# EAGLE design kombi_4x16Arelais01 (EAGLE 4.16)
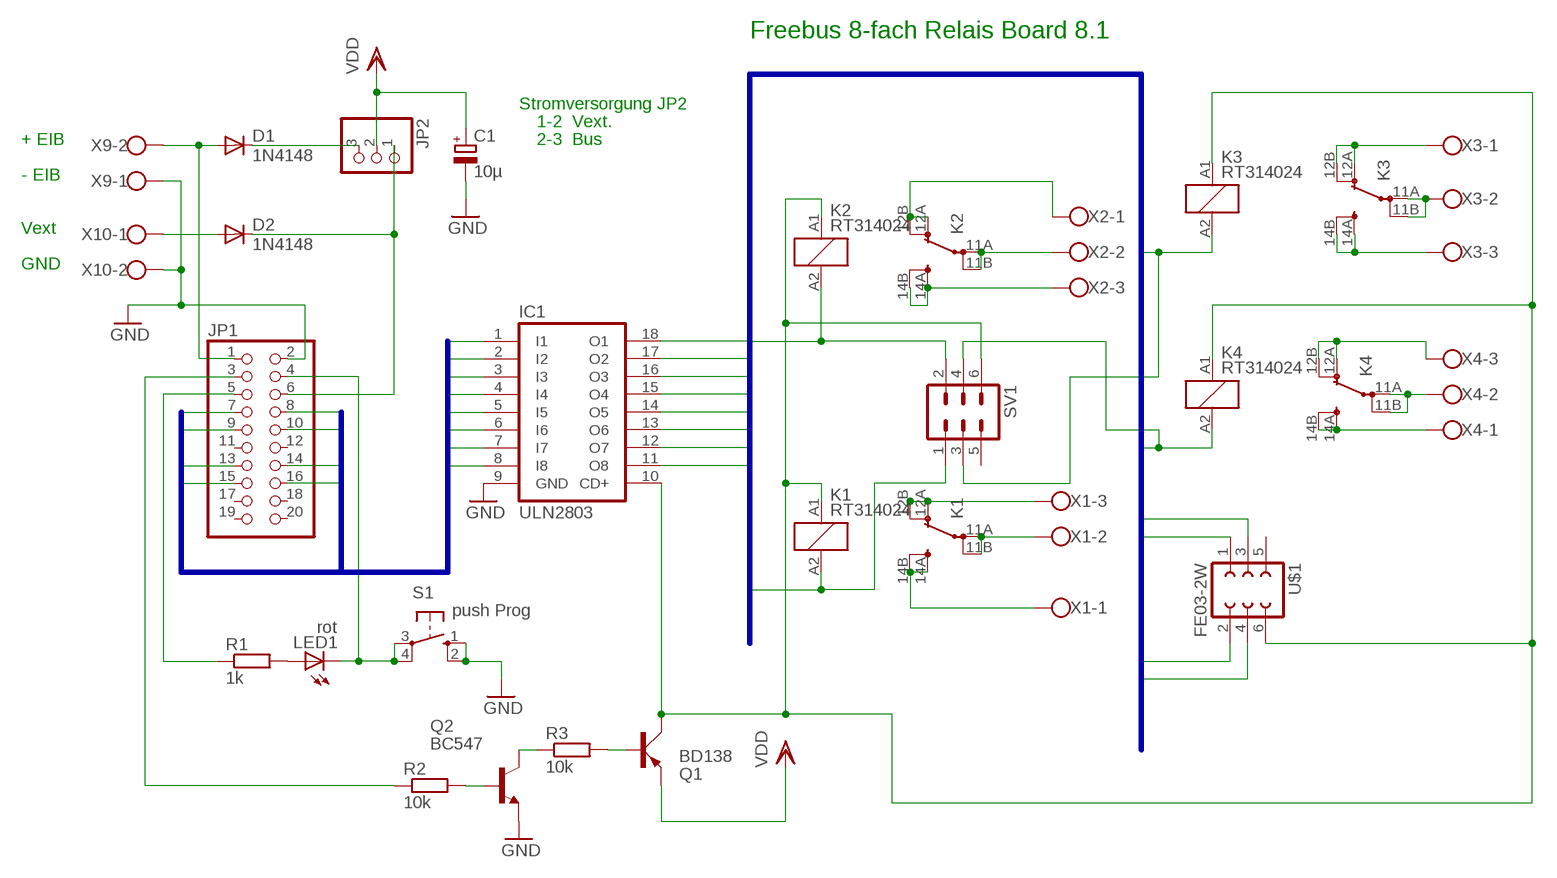
[diagram p0: schematic, sheet 1]

## Parts
C1  10µ  CPOL-EUE3.5-8  [E3,5-8]
D1  1N4148  [DO35-10]
D2  1N4148  [DO35-10]
IC1  ULN2803  ULN2803A  [DIL18]
JP1  PINHD-2X10  [2X10]
JP2  PINHD-1X3  [1X03]
K1  RT314024  [RT-C/O16A5]
K2  RT314024  [RT-C/O16A5]
K3  RT314024  [RT-C/O16A5]
K4  RT314024  [RT-C/O16A5]
LED1  rot  LED3MM  [LED3MM]
Q1  BD138  BD140  [TO126AV]
Q2  BC547  [TO92]
R1  1k  R-EU_0207/10  [0207/10]
R2  10k  R-EU_0207/10  [0207/10]
R3  10k  R-EU_0207/10  [0207/10]
S1  push Prog  10-XX  [B3F-10XX]
SV1  MA03-2LIEGEND  [MA03-2W]
U$1  FE03-2W  [FE03-2W]
X1  W237-03P  [W237-133]
X2  W237-03P  [W237-133]
X3  W237-03P  [W237-133]
X4  W237-03P  [W237-133]
X9  W237-102  [W237-102]
X10  W237-102  [W237-102]

## Nets
GND: C1.- IC1.9(GND) JP1.2 Q2.1(E) S1.1(S) S1.2(S1) X9.1 X10.2
IO1: IC1.1(I1) JP1.16
IO2: IC1.2(I2) JP1.15
IO3: IC1.3(I3) JP1.14
IO4: IC1.4(I4) JP1.13
IO5: IC1.5(I5) JP1.10
IO6: IC1.6(I6) JP1.9
IO7: IC1.7(I7) JP1.8
IO8: IC1.8(I8) JP1.7
N$7: K3.12A(2:OA) K3.12B(2:OB) X3.1
N$8: K4.14A(2:SA) K4.14B(2:SB) X4.1
N$9: K4.11A(2:PA) K4.11B(2:PB) X4.2
N$10: K4.12A(2:OA) K4.12B(2:OB) X4.3
N$11: K3.11A(2:PA) K3.11B(2:PB) X3.2
N$12: K3.14A(2:SA) K3.14B(2:SB) X3.3
N$13: K1.12A(2:OA) K1.12B(2:OB) X1.3
N$14: K1.11A(2:PA) K1.11B(2:PB) X1.2
N$15: K1.14A(2:SA) K1.14B(2:SB) X1.1
N$16: K2.14A(2:SA) K2.14B(2:SB) X2.3
N$17: D2.A X10.1
N$18: K2.11A(2:PA) K2.11B(2:PB) X2.2
N$19: K2.12A(2:OA) K2.12B(2:OB) X2.1
N$20: D1.A JP1.1 X9.2
N$24: JP1.5 R1.1
N$27: JP1.4 LED1.K(C) S1.3(P) S1.4(P1)
N$28: LED1.A R1.2
N$31: D2.C JP1.6 JP2.1
N$32: D1.C JP2.3
N$33: JP1.3 R2.1
N$37: Q1.B R3.2
N$38: Q2.3(C) R3.1
N$39: Q2.2(B) R2.2
PWM_RELAISE: IC1.10(CD+) K1.A1 K2.A1 K3.A1 K4.A1 Q1.C SV1.6 U$1.6
R1: IC1.14(O5) U$1.4
R2: IC1.13(O6) U$1.3
R3: IC1.12(O7) U$1.2
R4: IC1.11(O8) U$1.1
R5: IC1.15(O4) K4.A2 SV1.4
R6: IC1.16(O3) K3.A2 SV1.3
R7: IC1.17(O2) K2.A2 SV1.2
R8: IC1.18(O1) K1.A2 SV1.1
VDD: C1.+ JP2.2 Q1.E
Unconnected: JP1.11 JP1.12 JP1.17 JP1.18 JP1.19 JP1.20 SV1.5 U$1.5

## Buses
R[1..8]
IO[1..8]

## Notes on the sheet
- Freebus 8-fach Relais Board 8.1
- Stromversorgung JP2
- 1-2  Vext.
- + EIB | 2-3  Bus
- - EIB
- Vext
- GND

## Library data of the parts
C1 = rcl:CPOL-EU: POLARIZED CAPACITOR, European symbol
D1 D2 = diode:1N4148: DIODE high speed (Philips)
IC1 = uln-udn:ULN2803A: DRIVER ARRAY
JP1 = pinhead:PINHD-2X10: PIN HEADER
JP2 = pinhead:PINHD-1X3: PIN HEADER
K1-K4 = freebus_relay:RT31*: Power PCB Relayl SCHRACK 1 pole 12 / 16 A, DC- or AC-coi Source: http://www.schrack.com/.. 5819.pdf
LED1 = led:LED: LED OSRAM: - CHIPLED LG R971, LG N971, LY N971, LG Q971, LY Q971, LO R971, LY R971 LH N974, LH R974 LS Q976, LO Q976, LY Q976 LO Q996 - Hyper CHIPLED LW Q18S LB Q993, LB Q99A, LB R99A - SideLED LS A670, LO A670, LY A670, LG A670, LP A670 LB A673, LV A673, LT A673, LW A673 LH A674 LY A675 LS A676, LA A676, LO A676, LY A676, LW A676 LS A679, LY A679, LG A679 - Hyper Micro SIDELED® LS Y876, LA Y876, LO Y876, LY Y876 LT Y87S - SmartLED LW L88C, LW L88S LB L89C, LB L89S, LG L890 LS L89K, LO L89K, LY L89K LS L896, LA L896, LO L896, LY L896 - TOPLED LS T670, LO T670, LY T670, LG T670, LP T670 LSG T670, LSP T670, LSY T670, LOP T670, LYG T670 LG T671, LOG T671, LSG T671 LB T673, LV T673, LT T673, LW T673 LH T674 LS T676, LA T676, LO T676, LY T676, LB T676, LH T676, LSB T676, LW T676 LB T67C, LV T67C, LT T67C, LS T67K, LO T67K, LY T67K, LW E67C LS E67B, LA E67B, LO E67B, LY E67B, LB E67C, LV E67C, LT E67C LW T67C LS T679, LY T679, LG T679 LS T770, LO T770, LY T770, LG T770, LP T770 LB T773, LV T773, LT T773, LW T773 LH T774 LS E675, LA E675, LY E675, LS T675 LS T776, LA T776, LO T776, LY T776, LB T776 LHGB T686 LT T68C, LB T68C - Hyper Mini TOPLED® LB M676 - Mini TOPLED Santana® LG M470 LS M47K, LO M47K, LY M47K Source: http://www.osram.convergy.de - LUMILED® LXK2-PW12-R00, LXK2-PW12-S00, LXK2-PW14-U00, LXK2-PW14-V00 LXK2-PM12-R00, LXK2-PM12-S00, LXK2-PM14-U00 LXK2-PE12-Q00, LXK2-PE12-R00, LXK2-PE12-S00, LXK2-PE14-T00, LXK2-PE14-U00 LXK2-PB12-K00, LXK2-PB12-L00, LXK2-PB12-M00, LXK2-PB14-N00, LXK2-PB14-P00, LXK2-PB14-Q00 LXK2-PR12-L00, LXK2-PR12-M00, LXK2-PR14-Q00, LXK2-PR14-R00 LXK2-PD12-Q00, LXK2-PD12-R00, LXK2-PD12-S00 LXK2-PH12-R00, LXK2-PH12-S00 LXK2-PL12-P00, LXK2-PL12-Q00, LXK2-PL12-R00 Source: www.luxeon.com
Q1 = transistor-power:BD140: PNP TRANSISTOR
Q2 = transistor-npn:BC547*: NPN Transistor
R1-R3 = rcl:R-EU_: RESISTOR, European symbol
S1 = switch-omron:10-XX: OMRON SWITCH
SV1 = con-lstb:MA03-2: PIN HEADER
U$1 = con-lsta:FE03-2W
X1-X4 = con-wago-508:W237-03P: WAGO SREW CLAMP
X9 X10 = con-wago-500:W237-102: WAGO SCREW CLAMP

## Board
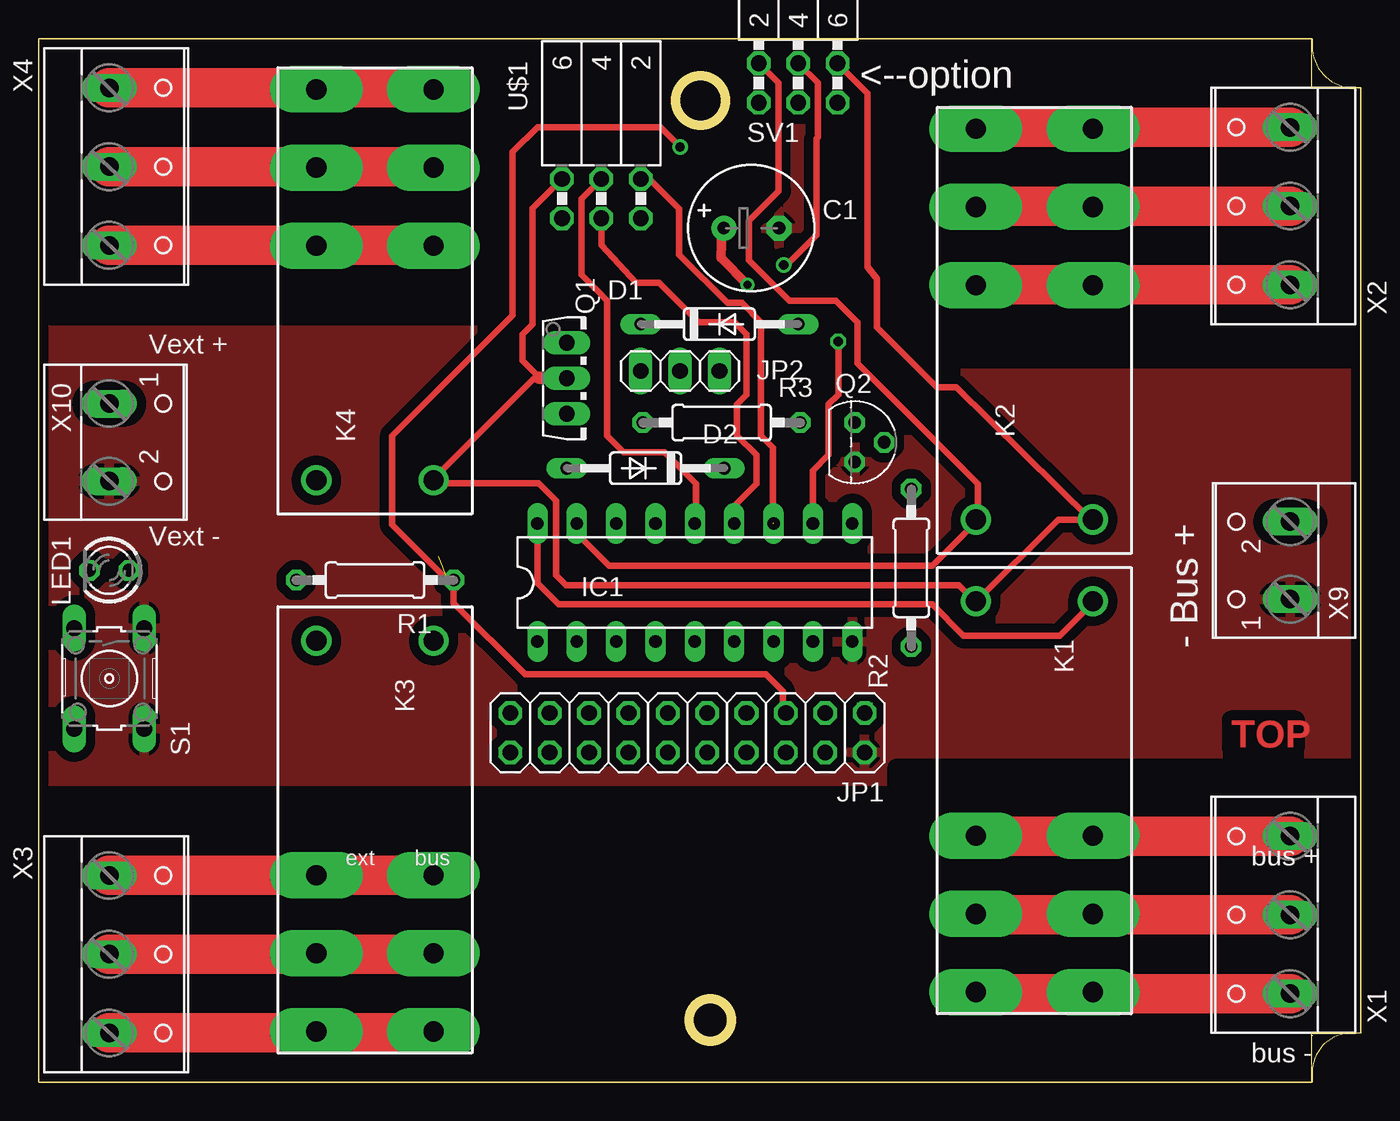
[diagram p1: board, top side]
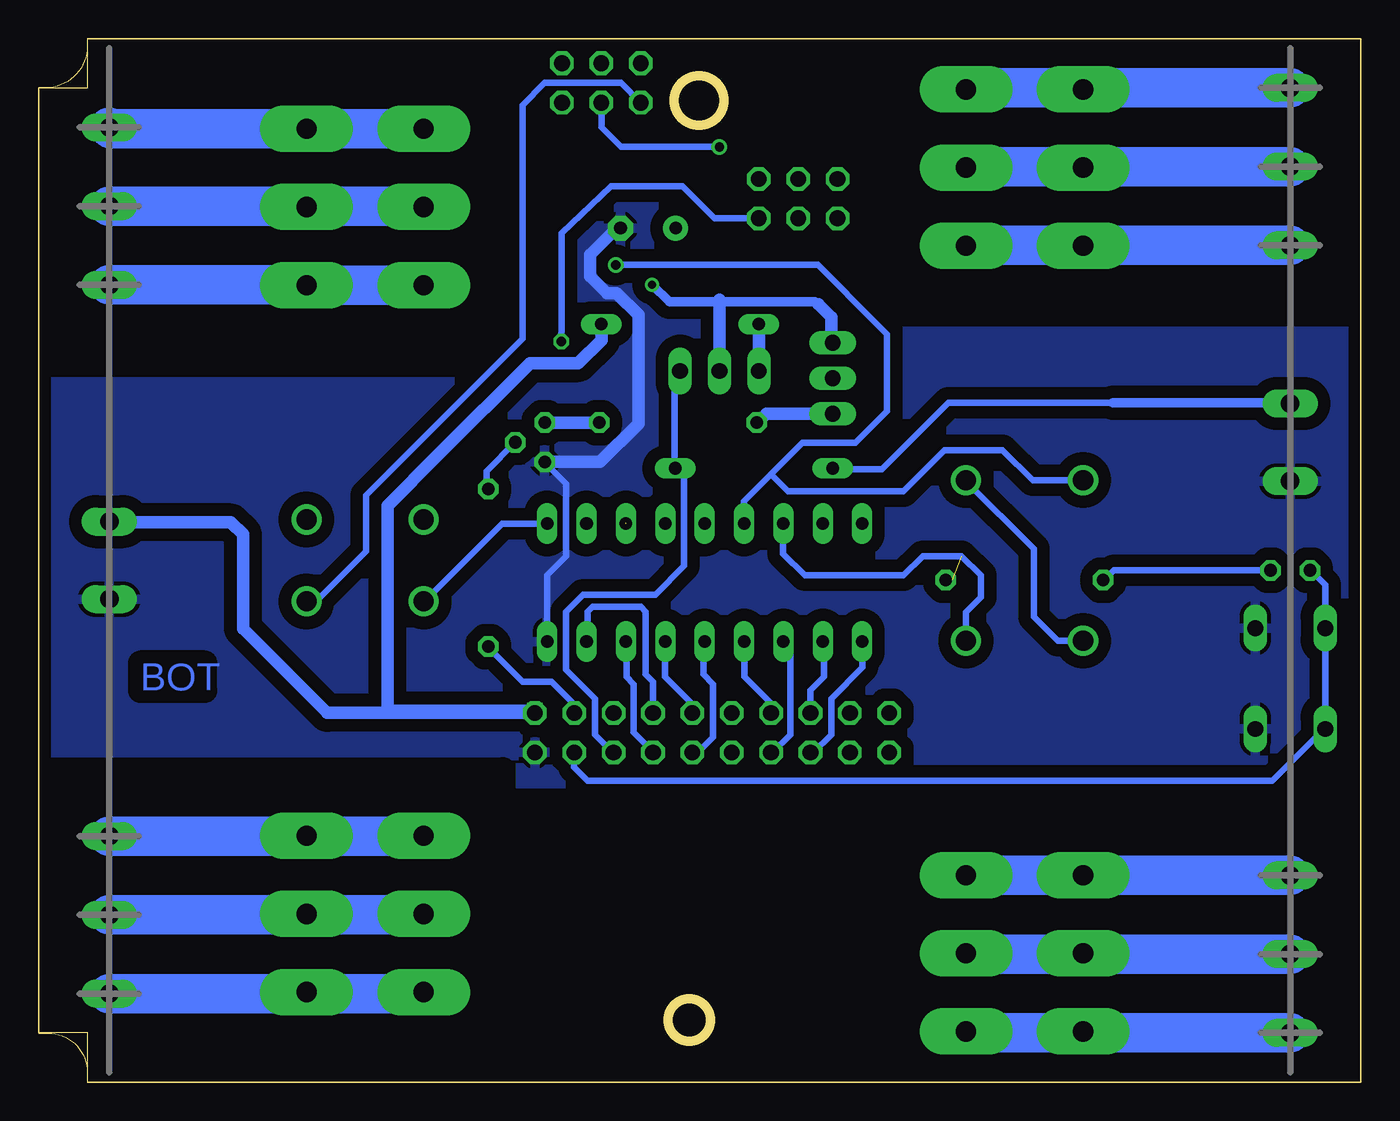
[diagram p2: board, bottom side, seen from below]

Size 85.3 x 67.3 mm. Coordinates in mm from the lower left corner, seen from the top.
Outline: 0,0.01 82.16,0 82.16,3.18 85.3,3.18 85.3,64.13 82.16,64.13 82.16,67.3 0,67.3 0,0.01
Outline: circle at 42.7,63.33 radius 1.59
Outline: circle at 43.33,4 radius 1.35
Copper layers (1*16): Top 0.035mm / dielectric 1.5mm / Bottom 0.035mm
Design rules "default": minimum track width 10mil, minimum drill 24mil, track to track 16mil, track to pad 12mil, pad to pad 16mil, via to via 16mil, smd to smd 8mil, copper to edge 20mil, drill to drill 10mil, minimum pad ring 10mil, minimum via ring 8mil, stop-mask expansion 4mil, vias tented up to drill 0mil, thermal gap 10mil
tRestrict: area -0.5,49.4 to 29.9,67.2; area 55.3,48.3 to 85.2,66.7; area 0.2,0.6 to 30,18.4; area 55.4,0.6 to 85.3,18.4; area 55.3,18.1 to 85.1,20.3; area 56.9,46.7 to 85.1,49.2
bRestrict: area -0.5,49.5 to 29.9,67.3; area 55.3,48.3 to 85.2,66.7; area 55.2,0.6 to 85,18.3; area 0,0.6 to 29.9,18.4; area 56.8,46.3 to 84.8,49.2; area 55.3,18 to 85.2,20.2
Milling: 15 lines

### Footprints (pad centres in the part's own frame; a part is rotated, then mirrored left to right if it is on the bottom)
E3,5-8 = drill 0.813 pad 1.6 round: + -1.778,0 | drill 0.813 pad 1.6 octagon: - 1.778,0
DO35-10 = drill 0.813 long: A 5.08,0; C -5.08,0
DIL18 = drill 0.813 long: 1 -10.16,-3.81; 2 -7.62,-3.81; 3 -5.08,-3.81; 4 -2.54,-3.81; 5 0,-3.81; 6 2.54,-3.81; 7 5.08,-3.81; 8 7.62,-3.81; 9 10.16,-3.81; 10 10.16,3.81; 11 7.62,3.81; 12 5.08,3.81; 13 2.54,3.81; 14 0,3.81; 15 -2.54,3.81; 16 -5.08,3.81; 17 -7.62,3.81; 18 -10.16,3.81
2X10 = drill 1.016 octagon: 1 -11.43,-1.27; 2 -11.43,1.27; 3 -8.89,-1.27; 4 -8.89,1.27; 5 -6.35,-1.27; 6 -6.35,1.27; 7 -3.81,-1.27; 8 -3.81,1.27; 9 -1.27,-1.27; 10 -1.27,1.27; 11 1.27,-1.27; 12 1.27,1.27; 13 3.81,-1.27; 14 3.81,1.27; 15 6.35,-1.27; 16 6.35,1.27; 17 8.89,-1.27; 18 8.89,1.27; 19 11.43,-1.27; 20 11.43,1.27
1X03 = drill 1.016 long: 1 -2.54,0; 2 0,0; 3 2.54,0
RT-C/O16A5 = drill 1.3 pad 3 long: 11A 7.56,3.78; 11B 7.56,-3.78; 12A 2.52,3.78; 12B 2.52,-3.78; 14A 12.6,3.78; 14B 12.6,-3.78 | drill 1.3 round: A1 -12.6,-3.78; A2 -12.6,3.78
LED3MM = drill 0.813 octagon: A -1.27,0; K 1.27,0
TO126AV = drill 1.016 long: B 2.286,-1.27; C 0,-1.27; E -2.286,-1.27
TO92 = drill 0.813 octagon: 1 1.27,0; 2 0,1.905; 3 -1.27,0
0207/10 = drill 0.813 octagon: 1 -5.08,0; 2 5.08,0
B3F-10XX = drill 1.016 long: 1 -3.251,2.261; 2 3.251,2.261; 3 -3.251,-2.261; 4 3.251,-2.261
MA03-2W = drill 1.016 octagon: 1 -2.54,-5.08; 2 -2.54,-2.54; 3 0,-5.08; 4 0,-2.54; 5 2.54,-5.08; 6 2.54,-2.54
FE03-2W = drill 1.016 octagon: 1 5.08,-5.08; 2 5.08,-2.54; 3 2.54,-5.08; 4 2.54,-2.54; 5 0,-5.08; 6 0,-2.54
W237-133 = drill 1.194 long: 1 -5.08,-0.635; 2 0,-0.635; 3 5.08,-0.635
W237-102 = drill 1.194 long: 1 -2.5,-1.27; 2 2.5,-1.27

### Placement (x,y rotation side)
C1  45.98,55.09 0 top
D1  43.92,48.89 0 top
D2  39.15,39.6 180 top
IC1  42.33,32.23 0 top
JP1  41.86,22.54 180 top
JP2  41.38,45.88 180 top
K1  64.24,18.42 270 top
K2  64.24,48.89 90 top
K3  21.7,15.88 270 top
K4  21.7,51.43 90 top
LED1  4.55,33.02 180 top
Q1  35.35,45.4 270 top
Q2  52.65,41.27 270 top
R1  21.7,32.38 180 top
R2  56.3,33.18 90 top
R3  44.06,42.54 180 top
S1  4.55,26.04 270 top
SV1  49,68.26 0 top
U$1  33.76,60.8 0 top
X1  80.11,10.79 90 top
X2  80.11,56.52 90 top
X3  5.18,8.26 270 top
X4  5.18,59.05 270 top
X9  79.48,33.66 90 top
X10  5.82,41.27 270 top

### Tracks (layer width: path | path; a pad name or v marks a point on that pad's centre or on a via)
GND
  Top 0.254: C1.- 47.73,55.24
  Bottom 0.254: 79.48,31.12 X9.1
  Bottom 0.406: IC1.9 52.49,32.71 51.28,33.93 51.28,38.59 52.68,40 52.67,40 Q2.1 | 47.85,55.24 47.76,55.15 C1.-
  Bottom 0.813: Q2.1 49.09,40 46.61,42.48 46.61,49.49 48.01,50.89 48.63,50.89 49.72,51.98 49.72,53.38 47.85,55.24
  pour Bottom (isolate 0.813): -1.15,67.31 85.83,67.31 86.47,66.68 86.62,19.27 -1.08,19.27
  pour Top (isolate 0.61): -0.53,67.79 85.83,67.79 85.83,19.42 -1.17,19.42 -1.17,67.95
IO1
  Bottom 0.406: JP1.16 35.31,21.27 34.16,22.42 34.16,24.75 32.14,26.77 32.14,28.48 32.17,28.45 IC1.1
IO2
  Bottom 0.406: JP1.15 35.51,25.27 34.63,26.15 34.63,28.33 IC1.2 | IC1.2 34.79,28.48 | IC1.2
IO3
  Bottom 0.406: JP1.14 37.95,21.27 36.81,22.42 36.81,27.86 37.27,28.33 37.25,28.35 IC1.3
IO4
  Bottom 0.406: JP1.13 38.05,24.43 39.76,26.15 39.76,28.48 39.79,28.45 IC1.4
IO5
  Bottom 0.406: JP1.10 42.77,21.27 41.79,22.26 41.79,25.68 42.41,26.31 42.41,28.33 42.33,28.4 IC1.5
IO6
  Bottom 0.406: JP1.9 43.13,24.38 44.9,26.15 44.9,28.33 44.81,28.42 | 44.81,28.42 44.74,28.48 | 44.81,28.42 IC1.6
IO7
  Bottom 0.406: JP1.8 45.67,21.32 46.92,22.57 46.92,25.68 47.39,26.15 47.39,28.33 47.41,28.35 IC1.7
IO8
  Bottom 0.406: JP1.7 45.67,25.83 46.14,26.31 46.14,30.35 46.45,30.66 49.56,30.66 49.88,30.35 49.88,28.64 50.03,28.48 49.96,28.42 IC1.8
N$7
  Top 2.54: X3.1 25.5,13.33
  Bottom 2.54: X3.1 17.89,13.33 K3.12B 17.93,13.33 25.49,13.33 | 25.49,13.33 25.5,13.33 | 25.49,13.33 K3.12A
N$8
  Top 2.54: X4.1 25.5,64.14
  Bottom 2.54: X4.1 17.91,64.14 | 25.47,64.14 25.5,64.14 | 25.47,64.14 K4.14B | 17.91,64.14 K4.14A | 17.91,64.14 25.47,64.14
N$9
  Top 2.54: X4.2 25.5,59.05
  Bottom 2.54: X4.2 17.91,59.05 | 25.47,59.05 25.5,59.05 | 25.47,59.05 K4.11B | 17.91,59.05 K4.11A | 17.91,59.05 25.47,59.05
N$10
  Top 2.54: X4.3 25.5,53.98
  Bottom 2.54: X4.3 17.91,53.98 | 25.47,53.98 25.5,53.98 | 25.47,53.98 K4.12B | 17.91,53.98 K4.12A | 17.91,53.98 25.47,53.98
N$11
  Top 2.54: X3.2 25.5,8.26
  Bottom 2.54: X3.2 17.91,8.26 | 25.47,8.26 25.5,8.26 | 25.47,8.26 K3.11A | 17.91,8.26 K3.11B | 17.91,8.26 25.47,8.26
N$12
  Top 2.54: X3.3 25.5,3.17
  Bottom 2.54: X3.3 17.88,3.17 17.88,3.25 K3.14B 18.02,3.17 25.5,3.17 25.5,3.25 K3.14A
N$13
  Top 2.54: X1.3 60.43,15.88
  Bottom 2.54: 68.05,15.88 X1.3 | 68.05,15.88 68.04,15.88 K1.12A | K1.12B 60.48,15.88 68.05,15.88
N$14
  Top 2.54: X1.2 60.43,10.79
  Bottom 2.54: K1.11B 60.52,10.79 68.05,10.79 68.05,10.82 K1.11A 68.08,10.79 X1.2
N$15
  Top 2.54: X1.1 60.43,5.71
  Bottom 2.54: K1.14B 60.56,5.71 68.05,5.71 68.05,5.79 K1.14A 68.12,5.71 X1.1
N$16
  Top 2.54: X2.3 60.43,61.59
  Bottom 2.54: 68.02,61.47 68.05,61.44 | 68.02,61.47 K2.14B 80.65,61.49 X2.3 | K2.14A 67.99,61.49 68.02,61.47
N$17
  Bottom 0.406: 15.98,43.81 26.61,43.81 30.9,39.53 34.01,39.53 34.07,39.59 D2.A
  Bottom 0.61: 15.98,43.81 5.82,43.81 X10.1
N$18
  Top 2.54: K2.11B 68.02,56.52 | 68.02,56.52 60.43,56.52 | X2.2 68.02,56.52
  Bottom 2.54: K2.11A 60.46,56.52 68.02,56.52 | 68.02,56.52 K2.11B | 68.02,56.52 X2.2
N$19
  Top 2.54: X2.1 60.43,51.43
  Bottom 0.406: K2.12B 68.05,51.43
  Bottom 2.54: K2.12A K2.12B | K2.12B | K2.12B 68.04,51.43 X2.1
N$20  (via drill 0.6)
  Top 0.406: v53.3,23.97 JP1.1
  Bottom 0.406: JP1.1 | X9.2 80.89,36.16 80.99,36.26 79.59,36.11
  Bottom 0.813: X9.2 79.48,36.2 | JP1.1 66.68,23.82 72.12,29.26 72.12,35.33 72.9,36.11 79.59,36.11 | D1.A 49,47.87 50.5,46.37 53.61,46.37 59.52,40.46 62.79,37.2 62.79,23.97 v53.3,23.97
N$24
  Top 0.406: R1.1 26.77,30.89 31.36,26.31 46.92,26.31 48.01,25.22 48.01,23.97 48.17,23.81 JP1.5
N$27
  Bottom 0.406: LED1.K 3.23,33.02 2.29,32.08 S1.3 2.27,29.26 2.29,29.24 S1.4 2.29,22.86 | JP1.4 50.75,20.33 49.88,19.46 5.69,19.46 2.29,22.86 | 2.29,22.86 2.27,22.88
N$28
  Bottom 0.406: R1.2 16.6,32.38 16.58,32.37 15.94,33.02 LED1.A
N$31
  Bottom 0.406: JP1.6 48.27,21.27 49.41,22.42 49.41,24.75 51.28,26.62 51.28,30.35 50.19,31.44 45.52,31.44 43.65,33.31 43.65,39.06 44.19,39.6 D2.C arc90 44.28,39.65 44.28,45.52 arc90 JP2.1
N$32
  Bottom 0.406: JP2.3 38.84,45.9 38.83,45.91 38.84,45.92
  Bottom 0.813: 38.84,45.92 D1.C
N$33
  Bottom 0.406: JP1.3 50.75,24.38 52.21,25.84 54.08,25.84 56.34,28.1 | 56.34,28.1 56.41,28.17 | 56.34,28.1 R2.1
N$37
  Bottom 0.813: R3.2 38.93,42.54 38.35,43.12 Q1.B
N$38
  Bottom 0.406: 52.65,42.77 52.68,42.8 | 52.65,42.77 Q2.3 | 52.43,42.54 52.65,42.77
  Bottom 0.813: R3.1 52.43,42.54
N$39
  Bottom 0.406: R2.2 56.33,38.28 56.41,38.28 56.41,39.42 Q2.2
PWM_RELAISE
  Top 0.406: U$1.6 31.85,56.36 31.85,48.89 31.21,48.24 31.21,46.53 32.14,45.6 | 32.14,45.6 32.3,45.44 | 34.16,45.44 34.12,45.4 Q1.C | 32.14,45.6 | 32.14,45.6 25.47,38.93 K4.A1 25.47,38.77 25.45,38.75 25.88,38.64 32.25,38.64 33.38,37.51 33.38,32.68 34.01,32.06 59.37,32.06 60.45,30.97 | 60.45,30.97 K1.A1 60.46,30.98 | 60.45,30.97 60.46,30.98 | 60.46,30.98 65.78,36.29 K2.A1 67.96,36.29 67.92,36.26 59.21,44.82 57.97,44.82 54.08,48.71 54.08,51.82 53.45,52.6 53.45,63.8 51.54,65.71 SV1.6
  Top 0.813: 32.3,45.44 34.16,45.44
  Bottom 0.406: K3.A1 19.53,28.48 21.09,30.04 21.09,34.39 25.47,38.77 K4.A1 | K1.A1 60.46,30.98 60.45,30.97 55.39,36.04 IC1.10
R1
  Top 0.406: U$1.4 35.03,56.99 35.03,52.07 36.3,50.8 36.3,50.77 36.65,50.42 36.65,41.71 37.74,40.62 40.39,40.62 42.41,38.59 42.41,35.95 IC1.14
R2
  Top 0.406: U$1.3 36.3,53.98 38.55,51.56 40.02,51.56 42.56,49.02 44.9,49.02 45.68,48.24 45.68,44.51 45.68,44.35 45.05,43.73 45.05,41.71 46.3,40.46 46.3,38.59 44.9,37.2 44.9,36.06 IC1.13
R3  (1 unrouted)
  Top 0.406: 47.41,36.08 47.39,38.28 47.39,40.93 46.61,41.71 46.61,49.02 45.37,50.26 44.43,50.26 41.32,53.38 41.32,56.33 39.39,58.26 U$1.2
R4  (via drill 0.6)
  Top 0.406: IC1.11 49.95,39.45 50.96,40.46 50.96,43.73 51.59,44.35 v51.59,47.77
  Bottom 0.406: U$1.1 41.7,55.72 43.76,57.78 48.37,57.78 51.55,54.75 51.55,48.89 v51.59,47.77
R5  (via drill 0.61)
  Top 0.406: v48.07,52.71 48.28,52.71 50.19,54.62 50.19,60.84 50.27,60.96 50.27,64.45 SV1.4 | K4.A2 18.52,38.73
  Bottom 0.254: K4.A2 18.52,38.73
  Bottom 0.406: v48.07,52.71 35.04,52.71 31.22,48.89 31.22,48.88 30.58,48.24 30.58,47.93 30.58,43.26 32.61,41.24 36.03,41.24 38.05,39.22 | 17.91,38.82 17.98,38.75 | K4.A2 17.91,38.82 | IC1.15 39.79,37.48 38.05,39.22 | 17.91,38.82 21.16,38.82 23.12,40.77 26.85,40.77 29.5,38.13 36.96,38.13 38.05,39.22
R6  (via drill 0.6)  (1 unrouted)
  Top 0.406: v41.38,60.32 40.11,61.59 32.17,61.59 30.58,60.01 30.58,51.51 30.58,49.48 22.81,41.71 22.81,35.95 26.38,32.37 26.7,32.37 | 25.45,28.48 25.46,28.48 K3.A2
  Bottom 0.406: v41.38,60.32 47.73,60.32 49,61.59 SV1.3 | K3.A2 25.47,30.33 24.52,31.28 24.52,32.68 25.76,33.93 28.25,33.93 29.5,32.68 35.88,32.68 37.27,34.08 37.27,36.11 37.25,36.08 IC1.16
R7
  Top 0.406: SV1.2 47.73,64.45 47.73,57.47 45.82,55.56 45.82,53.02 48.43,50.42 51.43,50.42 52.83,49.02 52.83,46.37 60.61,38.59 60.61,36.26 60.58,36.29 K2.A2 60.46,36.11 57.66,33.31 36.81,33.31 34.71,35.4 IC1.17
R8
  Top 0.406: IC1.18 32.17,32.19 33.54,30.82 57.66,30.82 59.68,28.79 65.9,28.79 68.02,30.91 K1.A2
  Bottom 0.406: SV1.1 47.73,64.45 52.65,64.45 54.08,63.02 54.08,47.96 64.19,37.85 64.19,34.24 67.46,30.97 67.98,30.97 K1.A2
VDD  (via drill 0.5)
  Top 0.61: v45.74,51.43 44.02,53.17 44.07,55.09 C1.+
  Bottom 0.406: 35,50.16 35.03,50.16 | Q1.E 34.16,47.77 | 44.59,50.35 41.48,50.42 41.38,50.48
  Bottom 0.61: 35.03,50.16 35.21,50.35 44.59,50.35 v45.74,51.43
  Bottom 0.813: 35,50.16 34.16,49.33 34.16,47.77 | 41.38,50.48 JP2.2

### Text on the board
Top: TOP
Bottom: BOT
tPlace: <--option | Vext + | Vext - | - Bus + | ext | bus | bus + | bus -